# Altium project RadiationDetector.PrjPcb (part 5 of 5)
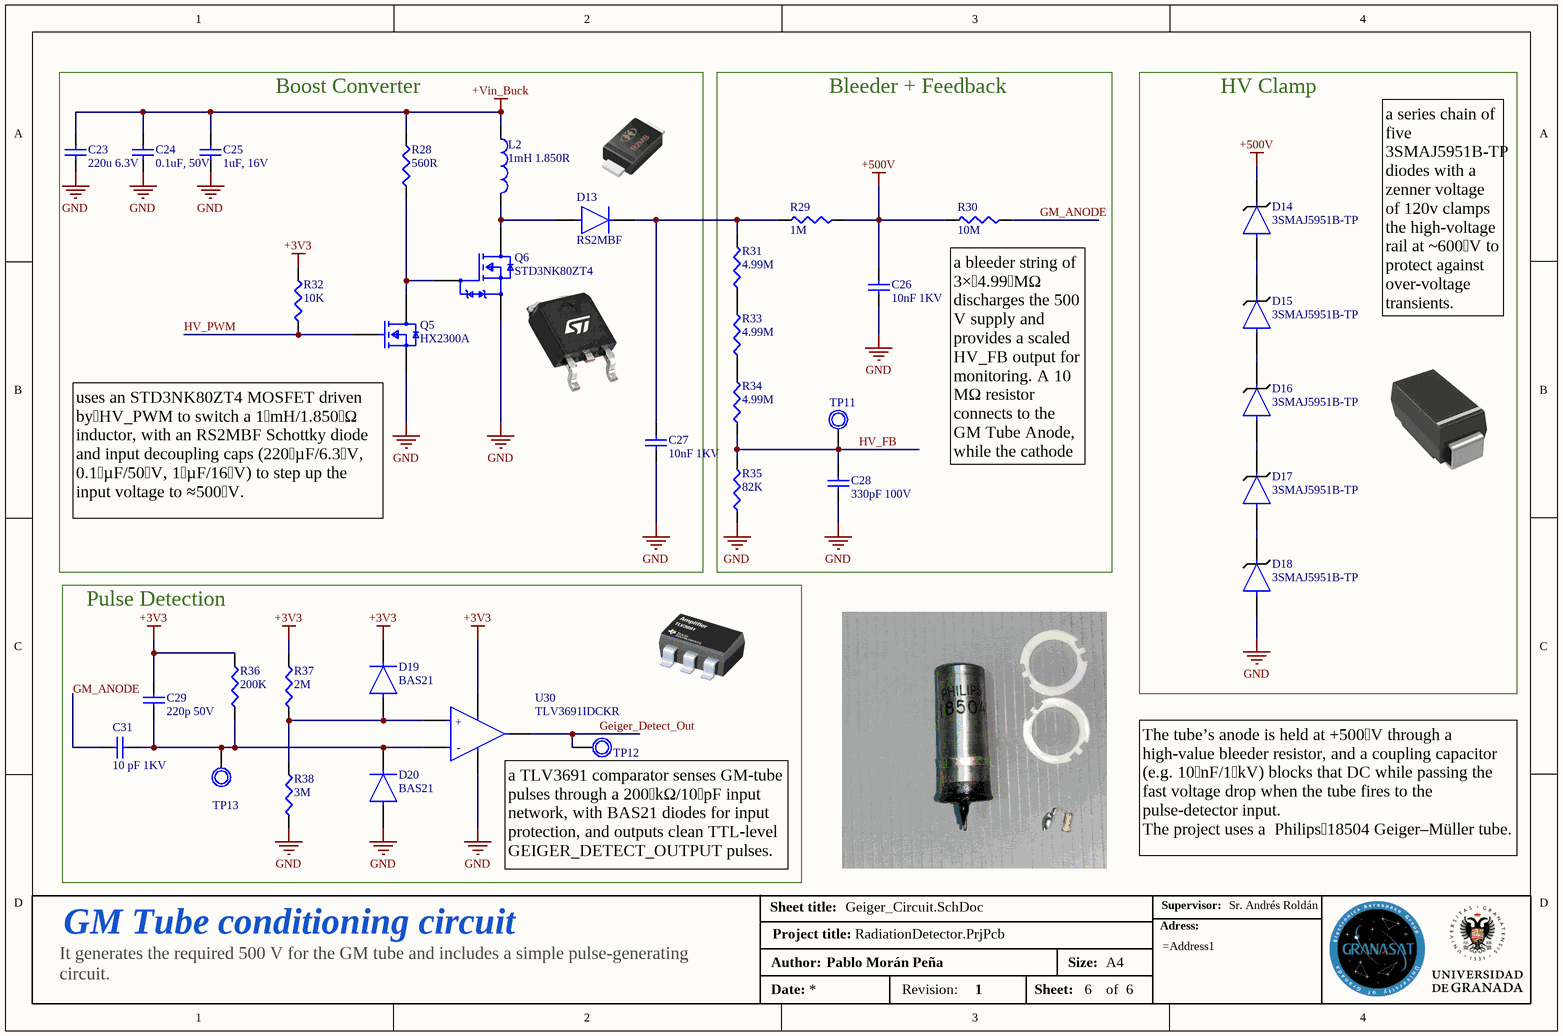
[diagram p6: Geiger_Circuit.SchDoc]

## Nets that join several sheets
+3V3: Microcontroller_Unit (C4.2 C5.2 ESP32-S3-WROOM-1U-N16R8.2 R2.2), IO_Ports (J1.1), Scintillator_Circuit (13 pins), Peripherals (C15.2 C16.2 SCREEN1.2), Power (C21.2 L1.2 R24.2 TP9.1), Geiger_Circuit (6 pins)
+5V: IO_Ports (6 pins), Power (6 pins)
+Vin_Buck: Power (6 pins), Geiger_Circuit (5 pins)
GND: Microcontroller_Unit (20 pins), IO_Ports (33 pins), Scintillator_Circuit (18 pins), Peripherals (C15.1 C16.1 LS1.2 SCREEN1.1), Power (12 pins), Geiger_Circuit (13 pins)
Bat_sens: Microcontroller_Unit (ESP32-S3-WROOM-1U-N16R8.17), Power (C22.2 R26.1 R27.1)
Buzzer_Signal: Microcontroller_Unit (ESP32-S3-WROOM-1U-N16R8.18), Peripherals (LS1.1)
DTR_FTDI: Microcontroller_Unit (Q2.2 R3.1), IO_Ports (U1.18)
ESP_USB_N: Microcontroller_Unit (ESP32-S3-WROOM-1U-N16R8.13), IO_Ports (D7.2 G2.A7 G2.B7)
ESP_USB_P: Microcontroller_Unit (ESP32-S3-WROOM-1U-N16R8.14), IO_Ports (D8.2 G2.A6 G2.B6)
Geiger_Detect_Out: Microcontroller_Unit (ESP32-S3-WROOM-1U-N16R8.11), Geiger_Circuit (TP12.1 U30.4)
GM_ANODE: IO_Ports (J1.3), Geiger_Circuit (C31.1 R30.2)
HV_FB: Microcontroller_Unit (ESP32-S3-WROOM-1U-N16R8.12), Geiger_Circuit (C28.2 R34.2 R35.2 TP11.1)
HV_PWM: Microcontroller_Unit (ESP32-S3-WROOM-1U-N16R8.10), Geiger_Circuit (Q5.1 R32.1)
RTS_FTDI: Microcontroller_Unit (Q1.2 R4.1), IO_Ports (U1.19)
Scint_Interrupt: Microcontroller_Unit (ESP32-S3-WROOM-1U-N16R8.5), Scintillator_Circuit (TP4.1 U2.6)
Scint_Out_Signal: Microcontroller_Unit (ESP32-S3-WROOM-1U-N16R8.4), Scintillator_Circuit (5 pins)
Scint_Reset: Microcontroller_Unit (ESP32-S3-WROOM-1U-N16R8.38), Scintillator_Circuit (Q3.1)
Screen_CLK: Microcontroller_Unit (ESP32-S3-WROOM-1U-N16R8.21), Peripherals (SCREEN1.7 SCREEN1.11)
Screen_CS: Microcontroller_Unit (ESP32-S3-WROOM-1U-N16R8.25), Peripherals (SCREEN1.3)
Screen_DC_RS: Microcontroller_Unit (ESP32-S3-WROOM-1U-N16R8.23), Peripherals (SCREEN1.5)
Screen_LED: Microcontroller_Unit (ESP32-S3-WROOM-1U-N16R8.31), Peripherals (SCREEN1.8)
Screen_MISO: Microcontroller_Unit (ESP32-S3-WROOM-1U-N16R8.20), Peripherals (SCREEN1.9 SCREEN1.13)
Screen_MOSI: Microcontroller_Unit (ESP32-S3-WROOM-1U-N16R8.22), Peripherals (SCREEN1.6 SCREEN1.12)
Screen_Reset: Microcontroller_Unit (ESP32-S3-WROOM-1U-N16R8.24), Peripherals (SCREEN1.4)
SD_CLK: Microcontroller_Unit (ESP32-S3-WROOM-1U-N16R8.9), Peripherals (SCREEN1.15)
SD_CS: Microcontroller_Unit (ESP32-S3-WROOM-1U-N16R8.6), Peripherals (SCREEN1.18)
SD_MISO: Microcontroller_Unit (ESP32-S3-WROOM-1U-N16R8.8), Peripherals (SCREEN1.16)
SD_MOSI: Microcontroller_Unit (ESP32-S3-WROOM-1U-N16R8.7), Peripherals (SCREEN1.17)
SIPM_SIGNAL: IO_Ports (J1.0), Scintillator_Circuit (C12.2 TP5.1 U4.3)
Touch_CS: Microcontroller_Unit (ESP32-S3-WROOM-1U-N16R8.19), Peripherals (SCREEN1.10)
U0RXD: Microcontroller_Unit (ESP32-S3-WROOM-1U-N16R8.36), IO_Ports (U1.17)
U0TXD: Microcontroller_Unit (ESP32-S3-WROOM-1U-N16R8.37), IO_Ports (U1.1)

## Assembly variants
Prototype: not fitted C1 C2